# Altium schematic sheet CANLink.SchDoc
size B; SheetNumber: 1; SheetTotal: 6
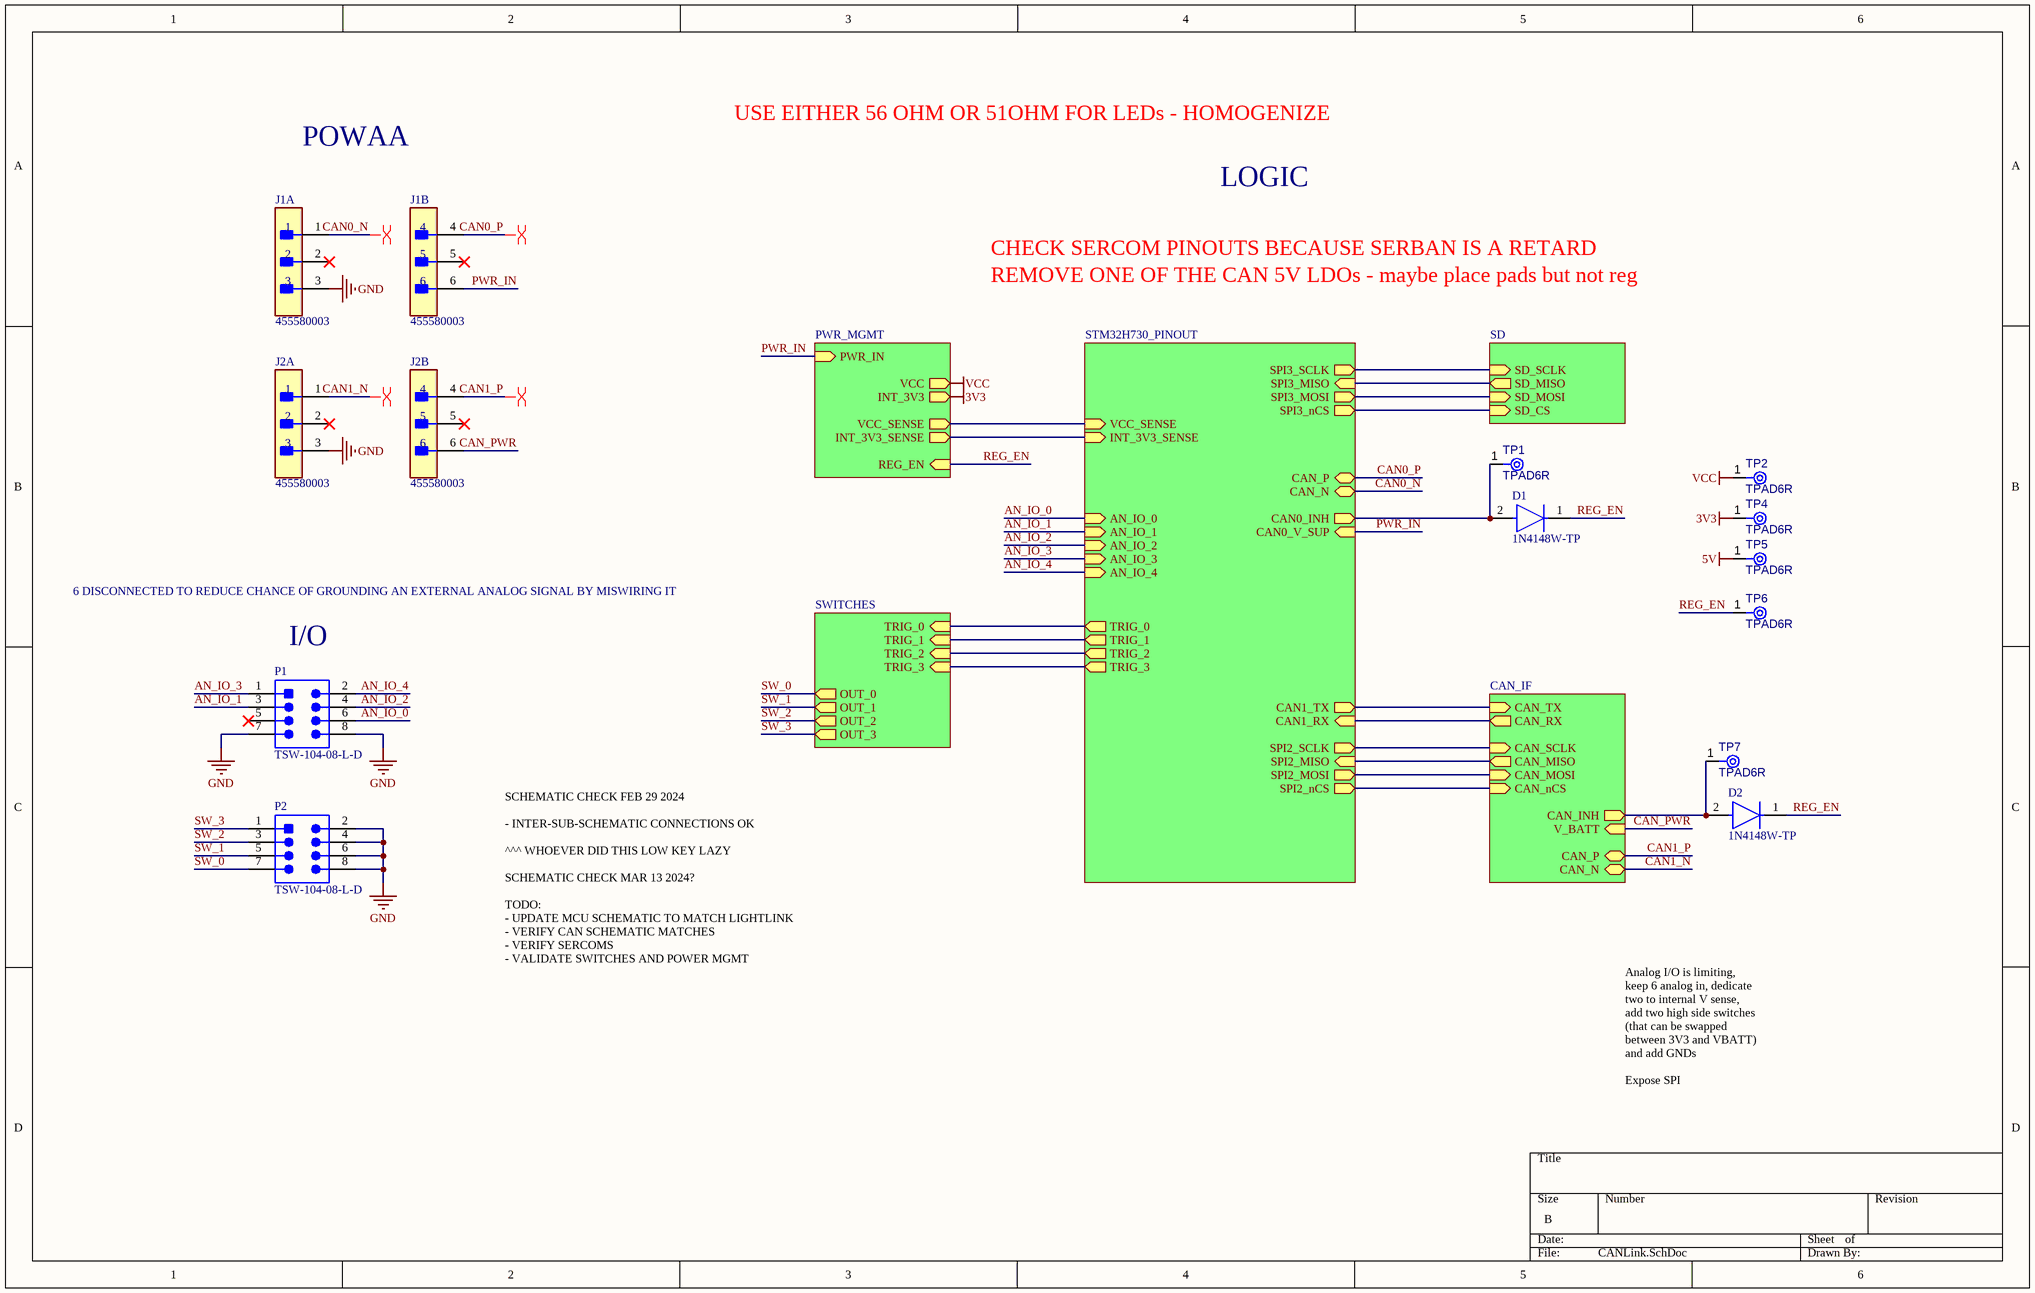
[diagram p0: CANLink.SchDoc]

## Parts
D1  1N4148W-TP  [FP-SOD-123-IPC_A]
D2  1N4148W-TP  [FP-SOD-123-IPC_A]
J1  455580003  [FP-455580003-MFG]  (parts A,B of 2)
J2  455580003  [FP-455580003-MFG]  (parts A,B of 2)
P1  TSW-104-08-L-D  [SMTC-TSW-104-08-L-D_V]
P2  TSW-104-08-L-D  [SMTC-TSW-104-08-L-D_V]
TP1  TPAD6R  [TP06R]  (no BOM)
TP2  TPAD6R  [TP06R]  (no BOM)
TP4  TPAD6R  [TP06R]  (no BOM)
TP5  TPAD6R  [TP06R]  (no BOM)
TP6  TPAD6R  [TP06R]  (no BOM)
TP7  TPAD6R  [TP06R]  (no BOM)

## Sub-sheets
CAN_1 = CAN_IF: CAN_TX (in), CAN_RX (out), CAN_SCLK (in), CAN_MISO (out), CAN_MOSI (in), CAN_nCS (in), CAN_INH (out), V_BATT (in), CAN_P (bidir), CAN_N (bidir)
MCU_0 = STM32H730_PINOUT: SPI2_MOSI (out), SPI2_MISO (in), SPI2_SCLK (out), SPI2_nCS (out), CAN1_TX (out), CAN1_RX (in), SPI3_MOSI (out), SPI3_MISO (in), SPI3_nCS (out), VCC_SENSE (in), INT_3V3_SENSE (in), AN_IO_1 (in), AN_IO_0 (in), AN_IO_2 (in), AN_IO_3 (in), AN_IO_4 (in), TRIG_0 (out), TRIG_1 (out), TRIG_2 (out), TRIG_3 (out), CAN0_INH (out), CAN_P (bidir), CAN_N (bidir), CAN0_V_SUP (in), SPI3_SCLK (out)
PWR_MGMT = PWR_MGMT: PWR_IN (in), VCC (out), INT_3V3 (out), VCC_SENSE (out), INT_3V3_SENSE (out), REG_EN (in)
SD_0 = SD: SD_MOSI (in), SD_CS (in), SD_MISO (out), SD_SCLK (in)
SWITCHES = SWITCHES: TRIG_0 (in), TRIG_1 (in), TRIG_2 (in), TRIG_3 (in), OUT_0 (out), OUT_1 (out), OUT_2 (out), OUT_3 (out)

## Nets
3V3: TP4.1(TP) ; sheet PWR_MGMT/INT_3V3
5V: TP5.1(TP)
GND: J1.3 J2.3 P1.7 P1.8 P2.2 P2.4 P2.6 P2.8
VCC: TP2.1(TP) ; sheet PWR_MGMT/VCC
AN_IO_0: P1.6 ; sheet MCU_0/AN_IO_0
AN_IO_1: P1.3 ; sheet MCU_0/AN_IO_1
AN_IO_2: P1.4 ; sheet MCU_0/AN_IO_2
AN_IO_3: P1.1 ; sheet MCU_0/AN_IO_3
AN_IO_4: P1.2 ; sheet MCU_0/AN_IO_4
CAN0_N: J1.1 ; sheet MCU_0/CAN_N
CAN0_P: J1.4 ; sheet MCU_0/CAN_P
CAN1_N: J2.1 ; sheet CAN_1/CAN_N
CAN1_P: J2.4 ; sheet CAN_1/CAN_P
CAN_PWR: J2.6 ; sheet CAN_1/V_BATT
PWR_IN: J1.6 ; sheet MCU_0/CAN0_V_SUP, sheet PWR_MGMT/PWR_IN
REG_EN: D1.1(C) D2.1(C) TP6.1(TP) ; sheet PWR_MGMT/REG_EN
SW_0: P2.7 ; sheet SWITCHES/OUT_0
SW_1: P2.5 ; sheet SWITCHES/OUT_1
SW_2: P2.3 ; sheet SWITCHES/OUT_2
SW_3: P2.1 ; sheet SWITCHES/OUT_3
NetD1_2: D1.2(A) TP1.1(TP) ; sheet MCU_0/CAN0_INH
NetD2_2: D2.2(A) TP7.1(TP) ; sheet CAN_1/CAN_INH
(unnamed): sheet MCU_0/SPI2_MOSI, sheet CAN_1/CAN_MOSI
(unnamed): sheet MCU_0/SPI2_MISO, sheet CAN_1/CAN_MISO
(unnamed): sheet MCU_0/SPI2_SCLK, sheet CAN_1/CAN_SCLK
(unnamed): sheet MCU_0/SPI2_nCS, sheet CAN_1/CAN_nCS
(unnamed): sheet MCU_0/CAN1_TX, sheet CAN_1/CAN_TX
(unnamed): sheet MCU_0/CAN1_RX, sheet CAN_1/CAN_RX
(unnamed): sheet MCU_0/SPI3_MOSI, sheet SD_0/SD_MOSI
(unnamed): sheet MCU_0/SPI3_MISO, sheet SD_0/SD_MISO
(unnamed): sheet MCU_0/SPI3_nCS, sheet SD_0/SD_CS
(unnamed): sheet MCU_0/VCC_SENSE, sheet PWR_MGMT/VCC_SENSE
(unnamed): sheet MCU_0/INT_3V3_SENSE, sheet PWR_MGMT/INT_3V3_SENSE
(unnamed): sheet MCU_0/TRIG_0, sheet SWITCHES/TRIG_0
(unnamed): sheet MCU_0/TRIG_1, sheet SWITCHES/TRIG_1
(unnamed): sheet MCU_0/TRIG_2, sheet SWITCHES/TRIG_2
(unnamed): sheet MCU_0/TRIG_3, sheet SWITCHES/TRIG_3
(unnamed): sheet MCU_0/SPI3_SCLK, sheet SD_0/SD_SCLK

Not connected (* = marked no-connect by the designer): J1 2* 5*; J2 2* 5*; P1 5*

## Layout directives
differential pair: CAN0_N, CAN0_P, CAN1_N, CAN1_P

## Notes on the sheet
- POWAA
- USE EITHER 56 OHM OR 51OHM FOR LEDs - HOMOGENIZE
- LOGIC
- CHECK SERCOM PINOUTS BECAUSE SERBAN IS A RETARD
- REMOVE ONE OF THE CAN 5V LDOs - maybe place pads but not reg
- 6 DISCONNECTED TO REDUCE CHANCE OF GROUNDING AN EXTERNAL ANALOG SIGNAL BY MISWIRING IT
- (near P1) I/O
- Analog I/O is limiting, keep 6 analog in, dedicate two to internal V sense, add two high side switches (that can be swapped between 3V3 and VBATT) and add GNDs
  Expose SPI
- SCHEMATIC CHECK FEB 29 2024
  - INTER-SUB-SCHEMATIC CONNECTIONS OK
  ^^^ WHOEVER DID THIS LOW KEY LAZY
  SCHEMATIC CHECK MAR 13 2024?
  TODO:
  - UPDATE MCU SCHEMATIC TO MATCH LIGHTLINK
  - VERIFY CAN SCHEMATIC MATCHES
  - VERIFY SERCOMS
  - VALIDATE SWITCHES AND POWER MGMT

## Library data of the parts
D1 D2 = CMP-2000-04993-2: DIODE GEN PURP 100V 150MA SOD123; Max Reverse Leakage Current: 5uA; Max Surge Current: 2A; Reverse Recovery Time: 4ns; Polarity: Standard; Capacitance: 4pF; Max Forward Surge Current (Ifsm): 1A; Element Configuration: Single; Power Dissipation: 400mW; Forward Voltage: 1V; Radiation Hardening: No; Lead Free: Lead Free; Max Reverse Voltage (DC): 100V; Current Rating: 150mA; Forward Current: 150mA; Packaging: Tape and Reel; Number of Pins: 2; Package Quantity: 3000; Max Operating Temperature: 150°C; Min Operating Temperature: -65°C; Average Rectified Current: 150mA; Recovery Time: 4ns; Output Current: 150mA; Peak Non-Repetitive Surge Current: 2A; Width: 1.8mm; Voltage Rating (DC): 100V; Height: 1.2mm; Max Repetitive Reverse Voltage (Vrrm): 100V; Mount: Surface Mount; Length: 2.85mm
J1 J2 = CMP-04776-000024-1: CONN HEADER R/A 6POS 4.2MM; Manufacturer: Molex; Standoff Height: 0.4mm; Conn Orientation: Right Angle; Number Of Contacts: 6; Conn Gender: Male; Voltage Rating: 600V; Current Rating: 8A; Footprint Url: https://www.molex.com/pdm_docs/sd/455580003_sd.pdf; Number Of Rows: 2; Lead Free: Yes; Digikey Description: CONN HEADER R/A 6POS 4.2MM; ComponentLink2URL: https://www.molex.com/webdocs/datasheets/pdf/en-us/0455580003_PCB_HEADERS.pdf; Octopart: https://octopart.com/45558-0003-molex-7672845; Package: 0; Device Class L3: unset; ComponentLink2Description: Datasheet; Device Class L2: Headers and Wire Housings; Category: Conn; Contact Material: Tin,Nickel; Mouser Description: Conn Power HDR 6 POS 4.2mm Solder ST Thru-Hole 6 Terminal 1 Port Mini-Fit Jr™ Tray; Manufacturer Part Number: 455580003; Pitch: 4.2mm; Device Class L1: Connectors; Temperature Range Low: -40°C; Temperature: -40°C to +105°C; RoHS: TRUE; Temperature Range High: +105°C; Height: 10.38mm; Automotive: No
P1 P2 = CMP-1681-00006-4: Male Header, Pitch 2.54 mm, 2 x 4 Position, Height 8.38 mm, Tail Length 5.08 mm, -55 to 125 degC, RoHS, Bulk; Manufacturer: Samtec; Voltage Rating: 550 V; Current Rating: 7.6 A; Rows: 2; ComponentLink2URL: https://datasheet.ciiva.com/25616/0900766b81154476-25616879.pdf; Package Quantity: 1; PackageDescription: Male Header, Pitch 2.54 mm, 2 x 4 Position, Height 8.38 mm, Tail Length 5.08 mm; ComponentLink1Description: Manufacturer URL; Lead Pitch: 0.1 inch; REACH SVHC: No SVHC; Mounting Technology: Through Hole; PackageReference: TSW-104-08-L-D; Contact Plating: Gold; DatasheetVersion: 04/2012; Colour: Black; Contact Finish: Gold; ComponentLink3URL: http://suddendocs.samtec.com/prints/tsw-xxx-xx-x-x-xx-xxx-footprint.pdf; ComponentLink3Description: Package Specification; Mount: Through Hole; RoHSCompliant: true; Packaging: Bulk; ComponentLink2Description: Datasheet; Contact Material: Bronze; Pins: 8; ComponentLink1URL: http://www.samtec.com/
TP1 TP2 TP4-TP7 = CMP-00028-00002-2: 0.6mm round; Pins: 1